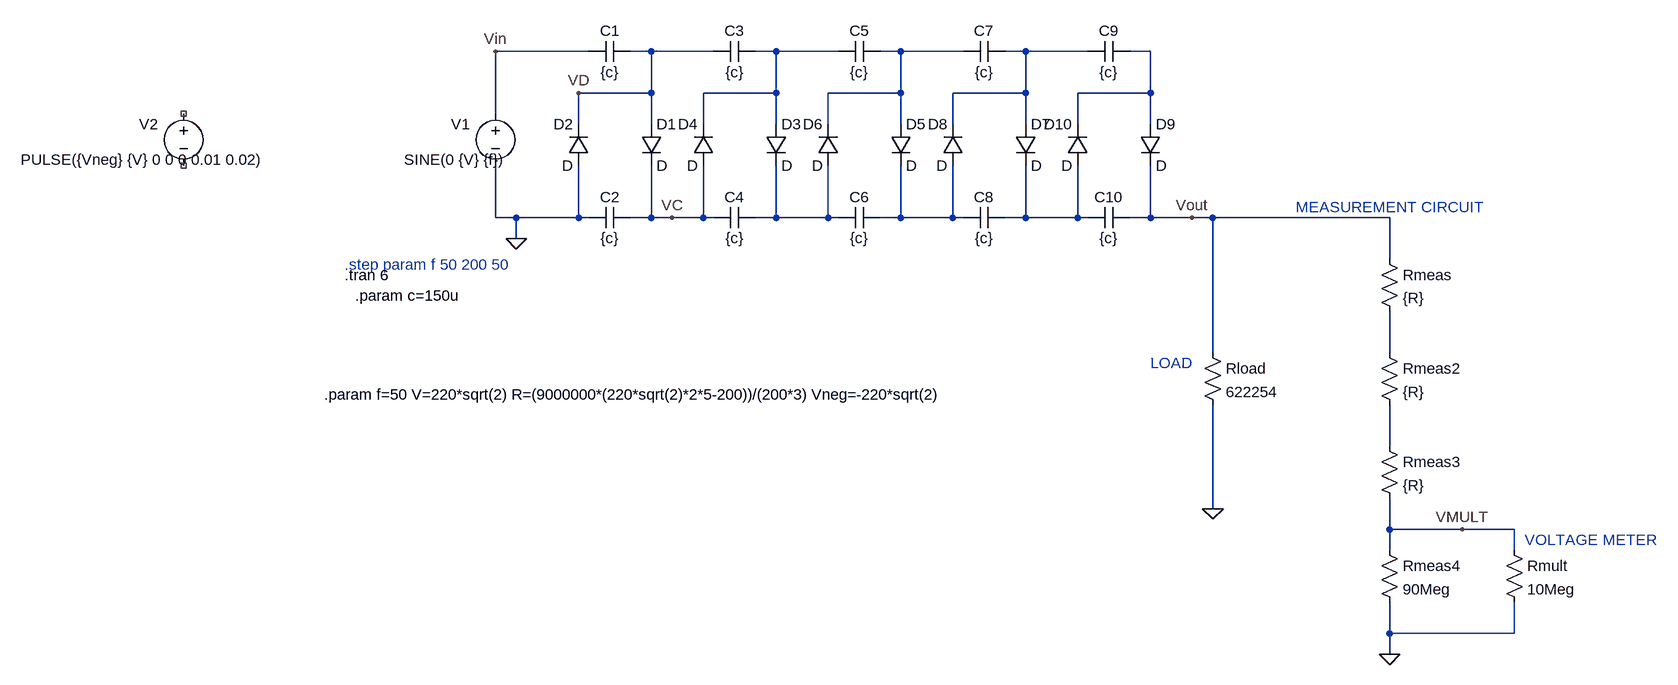
[diagram p0: schematic Multiplicador.asc]
Multiplicador.asc, the LTspice schematic file:
Version 4.1
SHEET 1 1876 1300
WIRE 240 80 96 80
WIRE 336 80 304 80
WIRE 432 80 336 80
WIRE 528 80 496 80
WIRE 624 80 528 80
WIRE 720 80 688 80
WIRE 816 80 720 80
WIRE 912 80 880 80
WIRE 1008 80 912 80
WIRE 1104 80 1072 80
WIRE 336 144 336 80
WIRE 336 144 224 144
WIRE 528 144 528 80
WIRE 528 144 416 144
WIRE 720 144 720 80
WIRE 720 144 608 144
WIRE 912 144 912 80
WIRE 912 144 800 144
WIRE 1104 144 1104 80
WIRE 1104 144 992 144
WIRE 96 176 96 80
WIRE 224 192 224 144
WIRE 336 192 336 144
WIRE 416 192 416 144
WIRE 528 192 528 144
WIRE 608 192 608 144
WIRE 720 192 720 144
WIRE 800 192 800 144
WIRE 912 192 912 144
WIRE 992 192 992 144
WIRE 1104 192 1104 144
WIRE 96 336 96 256
WIRE 128 336 96 336
WIRE 224 336 224 256
WIRE 224 336 128 336
WIRE 240 336 224 336
WIRE 336 336 336 256
WIRE 336 336 304 336
WIRE 368 336 336 336
WIRE 416 336 416 256
WIRE 416 336 368 336
WIRE 432 336 416 336
WIRE 528 336 528 256
WIRE 528 336 496 336
WIRE 608 336 608 256
WIRE 608 336 528 336
WIRE 624 336 608 336
WIRE 720 336 720 256
WIRE 720 336 688 336
WIRE 800 336 800 256
WIRE 800 336 720 336
WIRE 816 336 800 336
WIRE 912 336 912 256
WIRE 912 336 880 336
WIRE 992 336 992 256
WIRE 992 336 912 336
WIRE 1008 336 992 336
WIRE 1104 336 1104 256
WIRE 1104 336 1072 336
WIRE 1168 336 1104 336
WIRE 1200 336 1168 336
WIRE 1472 336 1200 336
WIRE 128 368 128 336
WIRE 1472 400 1472 336
WIRE 1200 544 1200 336
WIRE 1472 544 1472 480
WIRE 1472 688 1472 624
WIRE 1200 784 1200 624
WIRE 1472 816 1472 768
WIRE 1584 816 1472 816
WIRE 1664 816 1584 816
WIRE 1472 848 1472 816
WIRE 1664 848 1664 816
WIRE 1472 976 1472 928
WIRE 1664 976 1664 928
WIRE 1664 976 1472 976
WIRE 1472 1008 1472 976
FLAG 128 368 0
FLAG 1472 1008 0
FLAG 1200 784 0
FLAG 1168 336 Vout
FLAG 96 80 Vin
FLAG 224 144 VD
FLAG 368 336 VC
FLAG 1584 816 VMULT
SYMBOL diode 320 192 R0
SYMATTR InstName D1
SYMBOL diode 240 256 R180
WINDOW 0 24 64 Left 2
WINDOW 3 24 0 Left 2
SYMATTR InstName D2
SYMBOL cap 304 64 R90
WINDOW 0 0 32 VBottom 2
WINDOW 3 32 32 VTop 2
SYMATTR InstName C1
SYMATTR Value {c}
SYMBOL voltage 96 160 R0
WINDOW 0 -54 16 Top 2
WINDOW 3 -63 102 Bottom 2
WINDOW 123 0 0 Left 0
WINDOW 39 0 0 Left 0
SYMATTR InstName V1
SYMATTR Value SINE(0 {V} {f})
SYMBOL cap 304 320 R90
WINDOW 0 0 32 VBottom 2
WINDOW 3 32 32 VTop 2
SYMATTR InstName C2
SYMATTR Value {c}
SYMBOL diode 512 192 R0
SYMATTR InstName D3
SYMBOL diode 432 256 R180
WINDOW 0 24 64 Left 2
WINDOW 3 24 0 Left 2
SYMATTR InstName D4
SYMBOL cap 496 64 R90
WINDOW 0 0 32 VBottom 2
WINDOW 3 32 32 VTop 2
SYMATTR InstName C3
SYMATTR Value {c}
SYMBOL cap 496 320 R90
WINDOW 0 0 32 VBottom 2
WINDOW 3 32 32 VTop 2
SYMATTR InstName C4
SYMATTR Value {c}
SYMBOL diode 704 192 R0
SYMATTR InstName D5
SYMBOL diode 624 256 R180
WINDOW 0 24 64 Left 2
WINDOW 3 24 0 Left 2
SYMATTR InstName D6
SYMBOL cap 688 64 R90
WINDOW 0 0 32 VBottom 2
WINDOW 3 32 32 VTop 2
SYMATTR InstName C5
SYMATTR Value {c}
SYMBOL cap 688 320 R90
WINDOW 0 0 32 VBottom 2
WINDOW 3 32 32 VTop 2
SYMATTR InstName C6
SYMATTR Value {c}
SYMBOL diode 896 192 R0
SYMATTR InstName D7
SYMBOL diode 816 256 R180
WINDOW 0 24 64 Left 2
WINDOW 3 24 0 Left 2
SYMATTR InstName D8
SYMBOL cap 880 64 R90
WINDOW 0 0 32 VBottom 2
WINDOW 3 32 32 VTop 2
SYMATTR InstName C7
SYMATTR Value {c}
SYMBOL cap 880 320 R90
WINDOW 0 0 32 VBottom 2
WINDOW 3 32 32 VTop 2
SYMATTR InstName C8
SYMATTR Value {c}
SYMBOL diode 1088 192 R0
SYMATTR InstName D9
SYMBOL diode 1008 256 R180
WINDOW 0 24 64 Left 2
WINDOW 3 24 0 Left 2
SYMATTR InstName D10
SYMBOL cap 1072 64 R90
WINDOW 0 0 32 VBottom 2
WINDOW 3 32 32 VTop 2
SYMATTR InstName C9
SYMATTR Value {c}
SYMBOL cap 1072 320 R90
WINDOW 0 0 32 VBottom 2
WINDOW 3 32 32 VTop 2
SYMATTR InstName C10
SYMATTR Value {c}
SYMBOL res 1184 528 R0
SYMATTR InstName Rload
SYMATTR Value 622254
SYMBOL res 1456 672 R0
SYMATTR InstName Rmeas3
SYMATTR Value {R}
SYMBOL res 1456 832 R0
SYMATTR InstName Rmeas4
SYMATTR Value 90Meg
SYMBOL res 1648 832 R0
SYMATTR InstName Rmult
SYMATTR Value 10Meg
SYMBOL res 1456 528 R0
SYMATTR InstName Rmeas2
SYMATTR Value {R}
SYMBOL res 1456 384 R0
SYMATTR InstName Rmeas
SYMATTR Value {R}
SYMBOL voltage -384 160 R0
WINDOW 0 -54 16 Top 2
WINDOW 3 -63 102 Bottom 2
WINDOW 123 0 0 Left 0
WINDOW 39 0 0 Left 0
SYMATTR InstName V2
SYMATTR Value PULSE({Vneg} {V} 0 0 0 0.01 0.02)
TEXT -136 408 Left 2 ;.step param f 50 200 50
TEXT -136 424 Left 2 !.tran 6
TEXT -168 608 Left 2 !.param f=50 V=220*sqrt(2) R=(9000000*(220*sqrt(2)*2*5-200))/(200*3) Vneg=-220*sqrt(2)
TEXT -120 456 Left 2 !.param c=150u
TEXT 1104 560 Left 2 ;LOAD
TEXT 1328 320 Left 2 ;MEASUREMENT CIRCUIT
TEXT 1680 832 Left 2 ;VOLTAGE METER

The netlist it stands for:
* Multiplicador.asc
D1 VD VC D
D2 0 VD D
C1 VD Vin {c}
V1 Vin 0 SINE(0 {V} {f})
C2 VC 0 {c}
D3 N001 N005 D
D4 VC N001 D
C3 N001 VD {c}
C4 N005 VC {c}
D5 N002 N006 D
D6 N005 N002 D
C5 N002 N001 {c}
C6 N006 N005 {c}
D7 N003 N007 D
D8 N006 N003 D
C7 N003 N002 {c}
C8 N007 N006 {c}
D9 N004 Vout D
D10 N007 N004 D
C9 N004 N003 {c}
C10 Vout N007 {c}
Rload Vout 0 622254
Rmeas3 N009 VMULT {R}
Rmeas4 VMULT 0 90Meg
Rmult VMULT 0 10Meg
Rmeas2 N008 N009 {R}
Rmeas Vout N008 {R}
V2 NC_01 NC_02 PULSE({Vneg} {V} 0 0 0 0.01 0.02)
.model D D
.lib standard.dio
* .step param f 50 200 50
.tran 6
.param f=50 V=220*sqrt(2) R=(9000000*(220*sqrt(2)*2*5-200))/(200*3) Vneg=-220*sqrt(2)
.param c=150u
* LOAD
* MEASUREMENT CIRCUIT
* VOLTAGE METER
.backanno
.end